# Altium schematic sheet BatteryStackMonitor.SchDoc
size A
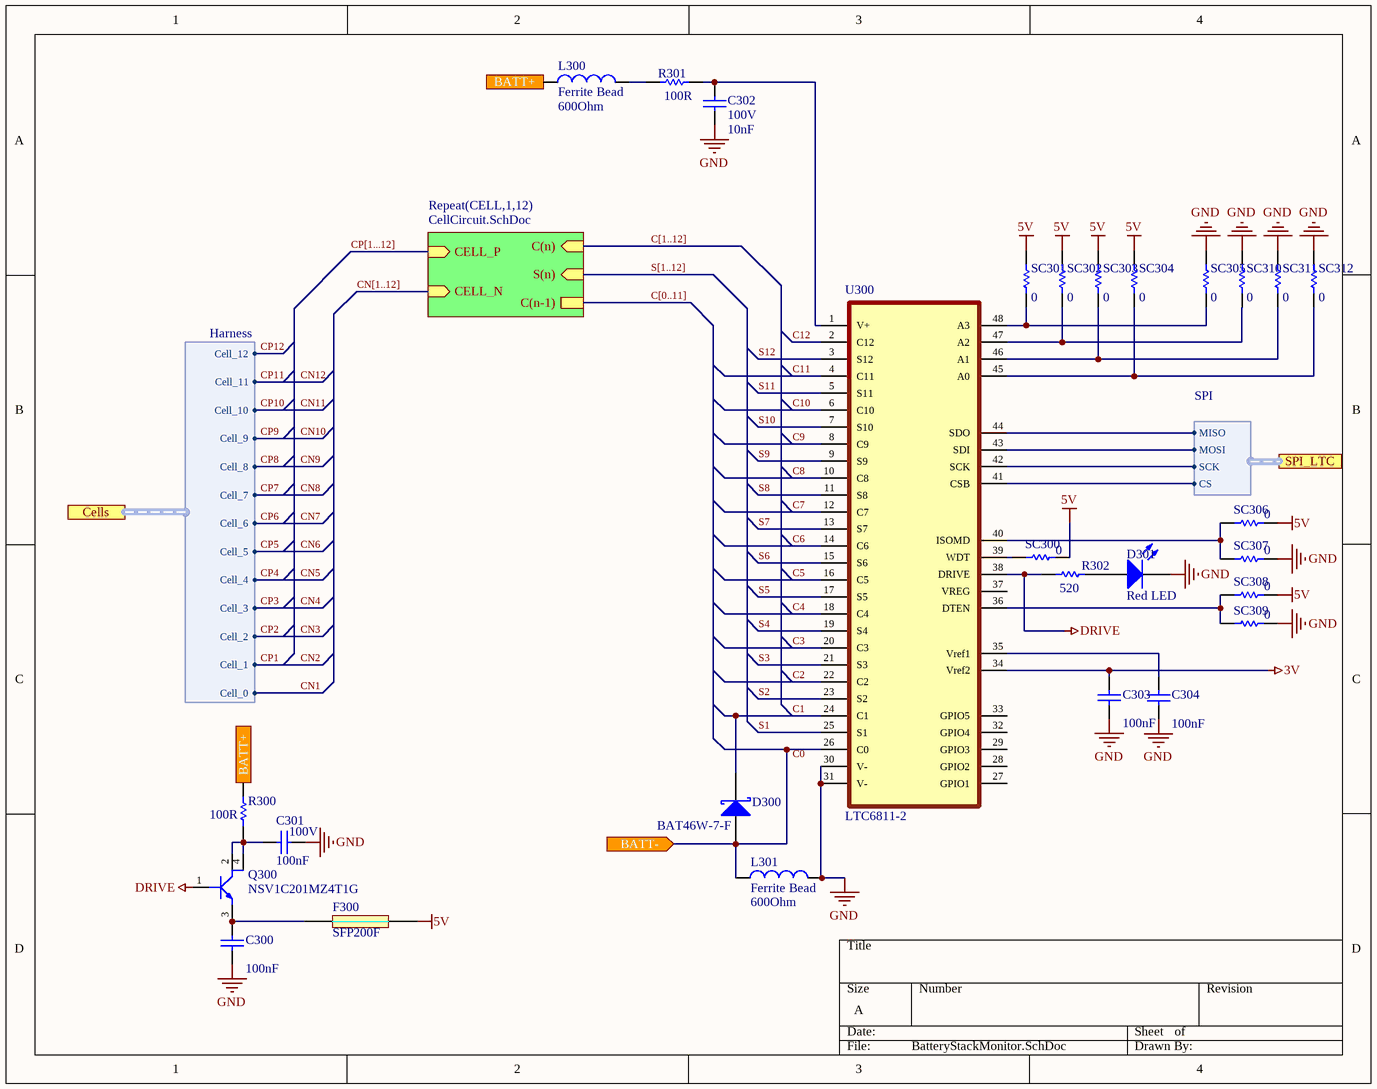
[diagram p0: BatteryStackMonitor.SchDoc]

## Parts
C300  value 100nF  [RAD-0.3]  (hidden comment: 100V)
C301  100V  value 100nF  [RAD-0.3]
C302  100V  value 10nF  [RAD-0.3]
C303  value 100nF  [RAD-0.3]  (hidden comment: 100V)
C304  value 100nF  [RAD-0.3]  (hidden comment: 100V)
D300  BAT46W-7-F  [SODFL370X135-2N]
D301  Red LED  [LED-0]
F300  SFP200F  [DIOC3216X12N]
L300  Ferrite Bead  value 600Ohm  [0402-A]
L301  Ferrite Bead  value 600Ohm  [0402-A]
Q300  NSV1C201MZ4T1G  [SOT230P700X180-4N]
R300  value 100R  [AXIAL-0.3]  (hidden comment: R0805)
R301  value 100R  [AXIAL-0.3]  (hidden comment: R0805)
R302  value 520  [AXIAL-0.3]  (hidden comment: R0805)
SC300  value 0  [AXIAL-0.3]  (hidden comment: Res1)
SC301  value 0  [AXIAL-0.3]  (hidden comment: Res1)
SC302  value 0  [AXIAL-0.3]  (hidden comment: Res1)
SC303  value 0  [AXIAL-0.3]  (hidden comment: Res1)
SC304  value 0  [AXIAL-0.3]  (hidden comment: Res1)
SC305  value 0  [AXIAL-0.3]  (hidden comment: Res1)
SC306  value 0  [AXIAL-0.3]  (hidden comment: Res1)
SC307  value 0  [AXIAL-0.3]  (hidden comment: Res1)
SC308  value 0  [AXIAL-0.3]  (hidden comment: Res1)
SC309  value 0  [AXIAL-0.3]  (hidden comment: Res1)
SC310  value 0  [AXIAL-0.3]  (hidden comment: Res1)
SC311  value 0  [AXIAL-0.3]  (hidden comment: Res1)
SC312  value 0  [AXIAL-0.3]  (hidden comment: Res1)
U300  LTC6811-2  [SSOP50P780X200-48N]

## Sub-sheets
Repeat(CELL,1,12) = CellCircuit.SchDoc: CELL_P (in), CELL_N (in), C(n) (in), C(n-1), S(n) (in)

## Ports
BATT+ (in), BATT- (in), Cells (harness Harness), SPI_LTC (harness SPI)

## Harnesses
Harness: Cell_0, Cell_1, Cell_2, Cell_3, Cell_4, Cell_5, Cell_6, Cell_7, Cell_8, Cell_9, Cell_10, Cell_11, Cell_12
SPI: MISO, MOSI, SCK, CS

## Nets
3V: C303.1 U300.34(Vref2)
5V: F300.2 SC300.1 SC301.2 SC302.2 SC303.2 SC304.2 SC306.2 SC308.2
DRIVE: Q300.1 R302.2 U300.38(DRIVE)
GND: C300.2 C301.2 C302.2 C303.2 C304.2 D301.2(K) L301.2 SC305.2 SC307.2 SC309.2 SC310.2 SC311.2 SC312.2 U300.30(V-) U300.31(V-)
BATT+: L300.1 R300.1 ; port BATT+
BATT-: D300.1(A) L301.1 U300.26(C0) ; port BATT-
C1: D300.3(K) U300.24(C1)
C2: U300.22(C2)
C3: U300.20(C3)
C4: U300.18(C4)
C5: U300.16(C5)
C6: U300.14(C6)
C7: U300.12(C7)
C8: U300.10(C8)
C9: U300.8(C9)
C10: U300.6(C10)
C11: U300.4(C11)
C12: U300.2(C12)
CN1: port Cells.Cell_0
CN2: port Cells.Cell_1  [also labelled CP1]
CN3: port Cells.Cell_2  [also labelled CP2]
CN4: port Cells.Cell_3  [also labelled CP3]
CN5: port Cells.Cell_4  [also labelled CP4]
CN6: port Cells.Cell_5  [also labelled CP5]
CN7: port Cells.Cell_6  [also labelled CP6]
CN8: port Cells.Cell_7  [also labelled CP7]
CN9: port Cells.Cell_8  [also labelled CP8]
CN10: port Cells.Cell_9  [also labelled CP9]
CN11: port Cells.Cell_10  [also labelled CP10]
CN12: port Cells.Cell_11  [also labelled CP11]
CP12: port Cells.Cell_12
S1: U300.25(S1)
S2: U300.23(S2)
S3: U300.21(S3)
S4: U300.19(S4)
S5: U300.17(S5)
S6: U300.15(S6)
S7: U300.13(S7)
S8: U300.11(S8)
S9: U300.9(S9)
S10: U300.7(S10)
S11: U300.5(S11)
S12: U300.3(S12)
NetC300_1: C300.1 F300.1 Q300.3
NetC301_1: C301.1 Q300.2 Q300.4
NetC302_1: C302.1 R301.1 U300.1(V+)
NetC304_1: C304.1 U300.35(Vref1)
NetD301_1: D301.1(A) R302.1
NetL300_2: L300.2 R301.2
NetSC300_2: SC300.2 U300.39(WDT)
NetSC301_1: SC301.1 SC305.1 U300.48(A3)
NetSC302_1: SC302.1 SC310.1 U300.47(A2)
NetSC303_1: SC303.1 SC311.1 U300.46(A1)
NetSC304_1: SC304.1 SC312.1 U300.45(A0)
NetSC306_1: SC306.1 SC307.1 U300.40(ISOMD)
NetSC308_1: SC308.1 SC309.1 U300.36(DTEN)
NetU300_41: U300.41(CSB) ; port SPI_LTC.CS
NetU300_42: U300.42(SCK) ; port SPI_LTC.SCK
NetU300_43: U300.43(SDI) ; port SPI_LTC.MOSI
NetU300_44: U300.44(SDO) ; port SPI_LTC.MISO

Not connected (* = marked no-connect by the designer): R300 2; U300 27(GPIO1) 28(GPIO2) 29(GPIO3) 32(GPIO4) 33(GPIO5) 37(VREG)

## Buses and harness runs
bus C[0..11]
bus C[1..12]
bus CN[1..12]
bus CP[1...12]
bus S[1..12]

## Notes on the sheet
- Labels drawn without touching a wire or pin: C0

## Library data of the parts
C300-C304 = Cap: Capacitor; Published: 8-Jun-2000; LatestRevisionDate: 17-Jul-2002; LatestRevisionNote: Re-released for DXP Platform.; PackageReference: RAD-0.3; Publisher: Altium Limited; PackageDescription: Radial Cap, Thru-Hole; 2 Leads; 0.3 in Pin Spacing
D300 = Diode BAT17: Silicon RF Schottky Diode for Mixer Applications in the VHF/UHF Range; Note: Pin 2 is not connected and not drawn.; Published: 21-Mar-2003; LatestRevisionDate: 29-May-2009; LatestRevisionNote: IPC-7351 Footprint Added.; DatasheetVersion: Oct-1999; PackageVersion: Sep-2001; PackageReference: SOT-23; Publisher: Altium Limited; PackageDescription: 3-Pin SOT-23 Package 0.95 mm Pitch, 2.5 mm Lead Span; ComponentLink1Description: Manufacturer Link; ComponentLink1URL: http://www.infineon.com/; ComponentLink2Description: Datasheet; ComponentLink2URL: http://www.infineon.com/upload/Document/cmc_upload/documents/009/363/bat17series.pdf
D301 = LED0: Typical INFRARED GaAs LED; Published: 8-Jun-2000; LatestRevisionDate: 08-Jul-2005; LatestRevisionNote: Mech Layer 1 removed.; PackageReference: LED-0; Publisher: Altium Limited; PackageDescription: LED; 2 Leads
F300 = SFP200F: Surface Mount Fuses VERY FAST GLASS CER 63V 2A SZ 1206
L300 = Inductor: Inductor Coil - Ferrite Bead; Code_IEC: 1005; Published: 8-Jun-2000; LatestRevisionDate: 29-May-2009; LatestRevisionNote: IPC-7351 Footprint Added.; PackageReference: 0402-A; Publisher: Altium Limited; PackageDescription: Chip Inductor; Code_JEITA: 0402
L301 = Inductor: Code_IEC: 1005; Published: 8-Jun-2000; LatestRevisionDate: 29-May-2009; LatestRevisionNote: IPC-7351 Footprint Added.; PackageReference: 0402-A; Publisher: Altium Limited; PackageDescription: Chip Inductor; Code_JEITA: 0402
Q300 = NSV1C201MZ4T1G: 100V, 2.0A, LOW Vce(sat), NPN Transistor
R300-R302 SC300-SC312 = Res1: Resistor; Published: 8-Jun-2000; LatestRevisionDate: 17-Jul-2002; LatestRevisionNote: Re-released for DXP Platform.; PackageReference: AXIAL-0.3; Publisher: Altium Limited; PackageDescription: Axial Device, Thru-Hole; 2 Leads; 0.3 in Pin Spacing
U300 = LTC6811-2: LTC6811-2, Multicell Battery Monitor, 48-Lead SSOP Package